# EAGLE design QRS_1_0 (EAGLE 7.6.0)
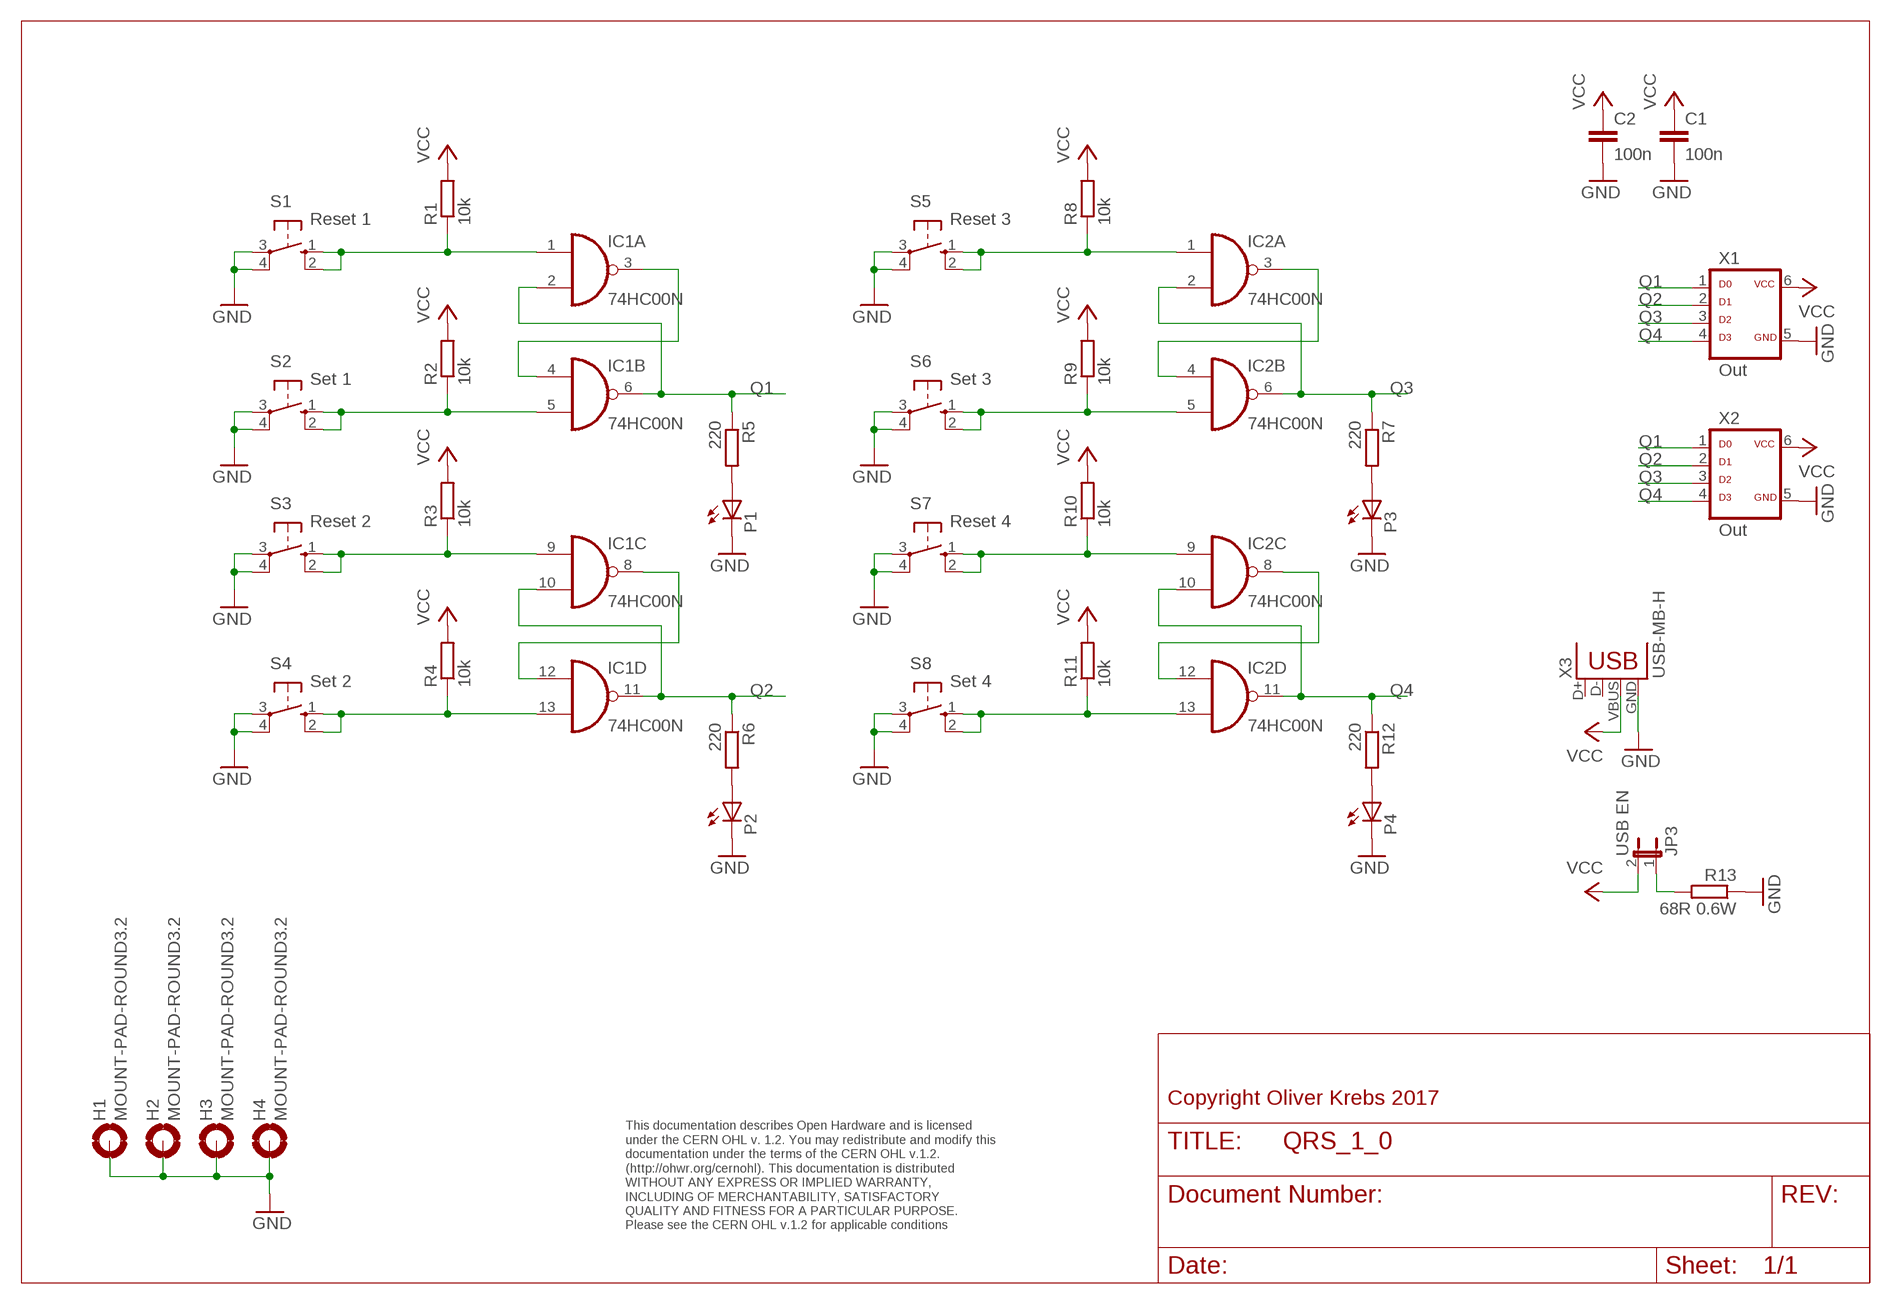
[diagram p0: schematic, sheet 1]

## Parts
C1  100n  C-EU050-025X075  [C050-025X075]
C2  100n  C-EU050-025X075  [C050-025X075]
H1  MOUNT-PAD-ROUND3.2  [3,2-PAD]
H2  MOUNT-PAD-ROUND3.2  [3,2-PAD]
H3  MOUNT-PAD-ROUND3.2  [3,2-PAD]
H4  MOUNT-PAD-ROUND3.2  [3,2-PAD]
IC1  74HC00N  [DIL14]
IC2  74HC00N  [DIL14]
JP3  USB EN  JP1E  [JP1]
P1  LED3MM  [LED3MM]
P2  LED3MM  [LED3MM]
P3  LED3MM  [LED3MM]
P4  LED3MM  [LED3MM]
R1  10k  R-EU_0207/10  [0207/10]
R2  10k  R-EU_0207/10  [0207/10]
R3  10k  R-EU_0207/10  [0207/10]
R4  10k  R-EU_0207/10  [0207/10]
R5  220  R-EU_0207/10  [0207/10]
R6  220  R-EU_0207/10  [0207/10]
R7  220  R-EU_0207/10  [0207/10]
R8  10k  R-EU_0207/10  [0207/10]
R9  10k  R-EU_0207/10  [0207/10]
R10  10k  R-EU_0207/10  [0207/10]
R11  10k  R-EU_0207/10  [0207/10]
R12  220  R-EU_0207/10  [0207/10]
R13  68R 0.6W  R-EU_0207/10  [0207/10]
S1  Reset 1  10-XX  [B3F-10XX]
S2  Set 1  10-XX  [B3F-10XX]
S3  Reset 2  10-XX  [B3F-10XX]
S4  Set 2  10-XX  [B3F-10XX]
S5  Reset 3  10-XX  [B3F-10XX]
S6  Set 3  10-XX  [B3F-10XX]
S7  Reset 4  10-XX  [B3F-10XX]
S8  Set 4  10-XX  [B3F-10XX]
X1  Out  ML6D  [ML-6]
X2  Out  ML6D  [ML-6]
X3  USB-MB-H  [USB-MB-H]

## Nets
GND: C1.2 C2.2 H1.B3,2(MOUNT) H2.B3,2(MOUNT) H3.B3,2(MOUNT) H4.B3,2(MOUNT) P1.K(C) P2.K(C) P3.K(C) P4.K(C) R13.1 S1.3(P) S1.4(P1) S2.3(P) S2.4(P1) S3.3(P) S3.4(P1) S4.3(P) S4.4(P1) S5.3(P) S5.4(P1) S6.3(P) S6.4(P1) S7.3(P) S7.4(P1) S8.3(P) S8.4(P1) X1.5 X2.5 X3.GND
N$1: IC1.1(A:I0) R1.1 S1.1(S) S1.2(S1)
N$2: JP3.1 R13.2
N$3: IC1.3(A:O) IC1.4(B:I0)
N$4: IC1.5(B:I1) R2.1 S2.1(S) S2.2(S1)
N$5: IC1.9(C:I0) R3.1 S3.1(S) S3.2(S1)
N$6: IC1.13(D:I1) R4.1 S4.1(S) S4.2(S1)
N$8: IC1.8(C:O) IC1.12(D:I0)
N$9: P1.A R5.2
N$10: P2.A R6.2
N$11: IC2.1(A:I0) R8.1 S5.1(S) S5.2(S1)
N$12: IC2.5(B:I1) R9.1 S6.1(S) S6.2(S1)
N$13: IC2.9(C:I0) R10.1 S7.1(S) S7.2(S1)
N$14: P3.A R7.2
N$16: IC2.3(A:O) IC2.4(B:I0)
N$17: IC2.13(D:I1) R11.1 S8.1(S) S8.2(S1)
N$19: IC2.8(C:O) IC2.12(D:I0)
N$20: P4.A R12.2
Q1: IC1.2(A:I1) IC1.6(B:O) R5.1 X1.1 X2.1
Q2: IC1.10(C:I1) IC1.11(D:O) R6.1 X1.2 X2.2
Q3: IC2.2(A:I1) IC2.6(B:O) R7.1 X1.3 X2.3
Q4: IC2.10(C:I1) IC2.11(D:O) R12.1 X1.4 X2.4
VCC: C1.1 C2.1 JP3.2 R1.2 R2.2 R3.2 R4.2 R8.2 R9.2 R10.2 R11.2 X1.6 X2.6 X3.VBUS
Unconnected: X3.D+ X3.D-

## Notes on the sheet
- Copyright Oliver Krebs 2017
- This documentation describes Open Hardware and is licensed 
  under the CERN OHL v. 1.2. You may redistribute and modify this 
  documentation under the terms of the CERN OHL v.1.2. 
  (http://ohwr.org/cernohl). This documentation is distributed
  WITHOUT ANY EXPRESS OR IMPLIED WARRANTY, 
  INCLUDING OF MERCHANTABILITY, SATISFACTORY 
  QUALITY AND FITNESS FOR A PARTICULAR PURPOSE. 
  Please see the CERN OHL v.1.2 for applicable conditions

## Power pins joined to a net without a drawn wire
GND: IC1.7(P:GND) IC2.7(P:GND)
VCC: IC1.14(P:VCC) IC2.14(P:VCC)

## Library data of the parts
C1 C2 = 01-my_rcl:C-EU: CAPACITOR, European symbol
H1-H4 = holes:MOUNT-PAD-ROUND: MOUNTING PAD, round
IC1 IC2 = 74xx-eu:74*00: Quad 2-input NAND gate
JP3 = jumper:JP1E: JUMPER
P1-P4 = 01-my-led:LED: LED OSRAM: - CHIPLED LG R971, LG N971, LY N971, LG Q971, LY Q971, LO R971, LY R971 LH N974, LH R974 LS Q976, LO Q976, LY Q976 LO Q996 - Hyper CHIPLED LW Q18S LB Q993, LB Q99A, LB R99A - SideLED LS A670, LO A670, LY A670, LG A670, LP A670 LB A673, LV A673, LT A673, LW A673 LH A674 LY A675 LS A676, LA A676, LO A676, LY A676, LW A676 LS A679, LY A679, LG A679 - Hyper Micro SIDELED® LS Y876, LA Y876, LO Y876, LY Y876 LT Y87S - SmartLED LW L88C, LW L88S LB L89C, LB L89S, LG L890 LS L89K, LO L89K, LY L89K LS L896, LA L896, LO L896, LY L896 - TOPLED LS T670, LO T670, LY T670, LG T670, LP T670 LSG T670, LSP T670, LSY T670, LOP T670, LYG T670 LG T671, LOG T671, LSG T671 LB T673, LV T673, LT T673, LW T673 LH T674 LS T676, LA T676, LO T676, LY T676, LB T676, LH T676, LSB T676, LW T676 LB T67C, LV T67C, LT T67C, LS T67K, LO T67K, LY T67K, LW E67C LS E67B, LA E67B, LO E67B, LY E67B, LB E67C, LV E67C, LT E67C LW T67C LS T679, LY T679, LG T679 LS T770, LO T770, LY T770, LG T770, LP T770 LB T773, LV T773, LT T773, LW T773 LH T774 LS E675, LA E675, LY E675, LS T675 LS T776, LA T776, LO T776, LY T776, LB T776 LHGB T686 LT T68C, LB T68C - Hyper Mini TOPLED® LB M676 - Mini TOPLED Santana® LG M470 LS M47K, LO M47K, LY M47K Source: http://www.osram.convergy.de LUXEON: - LUMILED® LXK2-PW12-R00, LXK2-PW12-S00, LXK2-PW14-U00, LXK2-PW14-V00 LXK2-PM12-R00, LXK2-PM12-S00, LXK2-PM14-U00 LXK2-PE12-Q00, LXK2-PE12-R00, LXK2-PE12-S00, LXK2-PE14-T00, LXK2-PE14-U00 LXK2-PB12-K00, LXK2-PB12-L00, LXK2-PB12-M00, LXK2-PB14-N00, LXK2-PB14-P00, LXK2-PB14-Q00 LXK2-PR12-L00, LXK2-PR12-M00, LXK2-PR14-Q00, LXK2-PR14-R00 LXK2-PD12-Q00, LXK2-PD12-R00, LXK2-PD12-S00 LXK2-PH12-R00, LXK2-PH12-S00 LXK2-PL12-P00, LXK2-PL12-Q00, LXK2-PL12-R00 Source: www.luxeon.com KINGBRIGHT: KA-3528ASYC Source: www.kingbright.com
R1-R13 = 01-my_rcl:R-EU_: RESISTOR, European symbol
S1-S8 = switch-omron:10-XX: OMRON SWITCH; MPN: B3F-1000; OC_FARNELL: 176432; OC_NEWARK: 36M3542
X1 X2 = 01-my-con:ML6D
X3 = SparkFun-Connectors:USB: USB Connectors USB-B-PTH is fully proven SKU : PRT-00139/CONN-08278 USB-miniB is fully proven SKU : PRT-00587 USB-A-PCB is untested. USB-A-H is throughly reviewed, but untested. Spark Fun Electronics SKU : PRT-00437 USB-B-SMT is throughly reviewed, but untested. Needs silkscreen touching up. USB-A-S has not been used/tested USB-MB-H has not been used/tested USB-MICROB has been used. CONN-09505

## Board
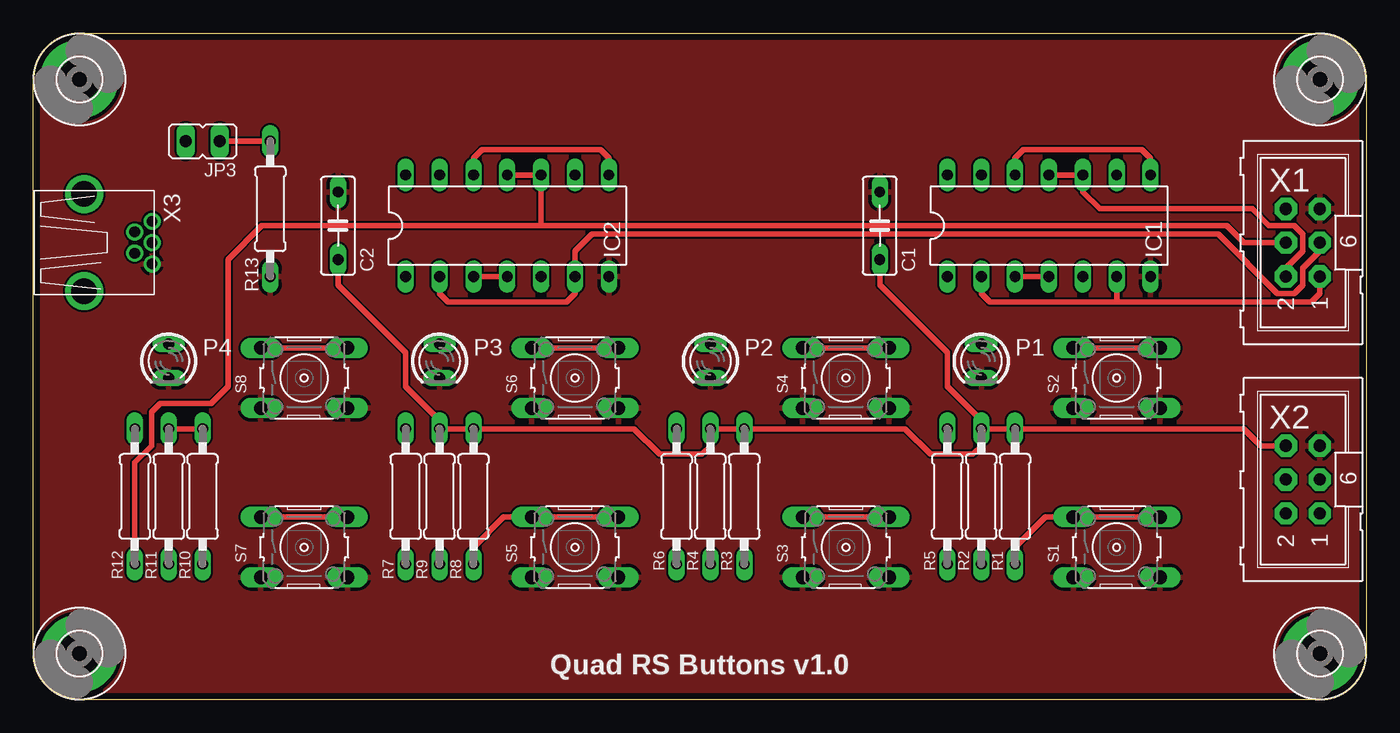
[diagram p1: board, top side]
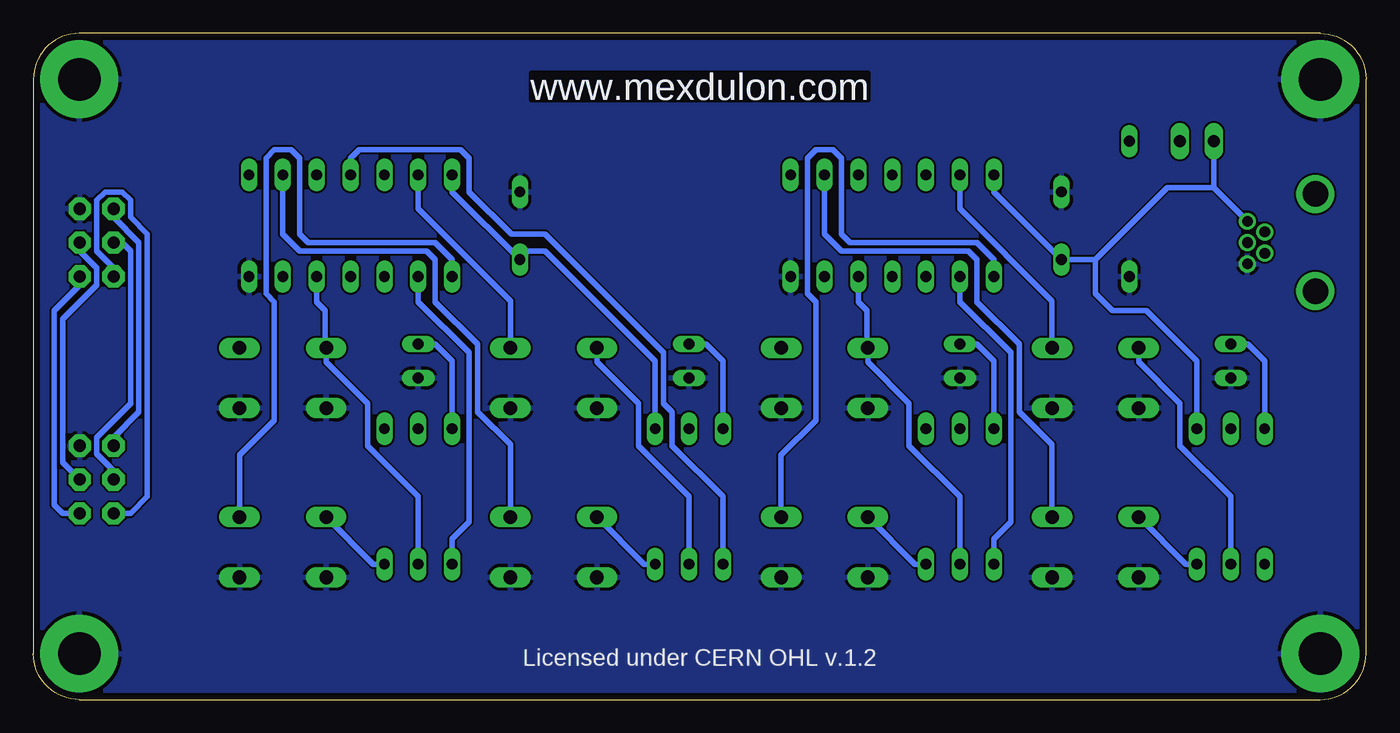
[diagram p2: board, bottom side, seen from below]

Size 100 x 50 mm. Coordinates in mm from the lower left corner, seen from the top.
Outline: 0,3.45 0,46.55 arc-90 3.45,50 96.55,50 arc-90 100,46.55 100,3.45 arc-90 96.55,0 3.45,0 arc-90 0,3.45
Copper layers (1*16): Top 0.035mm / dielectric 1.6mm / Bottom 0.035mm
Design rules "Elecrow_2-layer_PCB_eagle_rule": minimum track width 6mil, minimum drill 12mil, track to track 6mil, track to pad 6mil, pad to pad 6mil, via to via 8mil, smd to smd 0mil, copper to edge 20mil, drill to drill 10mil, minimum pad ring 6mil, minimum via ring 6mil, stop-mask expansion 0mil, vias tented up to drill 100mil, thermal gap 10mil

### Footprints (pad centres in the part's own frame; a part is rotated, then mirrored left to right if it is on the bottom)
C050-025X075 = drill 0.813 long: 1 -2.54,0; 2 2.54,0
3,2-PAD = drill 3.2 pad 5.842: B3,2 0,0
DIL14 = drill 0.813 long: 1 -7.62,-3.81; 2 -5.08,-3.81; 3 -2.54,-3.81; 4 0,-3.81; 5 2.54,-3.81; 6 5.08,-3.81; 7 7.62,-3.81; 8 7.62,3.81; 9 5.08,3.81; 10 2.54,3.81; 11 0,3.81; 12 -2.54,3.81; 13 -5.08,3.81; 14 -7.62,3.81
JP1 = drill 0.914 long: 1 0,-1.27; 2 0,1.27
LED3MM = drill 0.813 long: A -1.27,0; K 1.27,0
0207/10 = drill 0.813 long: 1 -5.08,0; 2 5.08,0
B3F-10XX = drill 1.016 long: 1 -3.251,2.261; 2 3.251,2.261; 3 -3.251,-2.261; 4 3.251,-2.261
ML-6 = drill 0.914 pad 1.676 octagon: 1 -2.54,-1.27; 2 -2.54,1.27; 3 0,-1.27; 4 0,1.27; 5 2.54,-1.27; 6 2.54,1.27
USB-MB-H = drill 0.8 pad 1.27: D+ 5.1,0; D- 3.8,0.8; GND 5.1,-1.6; ID 3.8,-0.8; VBUS 5.1,1.6 | drill 1.9: P$6 0,-3.65; P$7 0,3.65

### Placement (x,y rotation side)
C1  63.5,35.56 90 top
C2  22.86,35.56 90 top
H1  3.45,3.45 0 top
H2  3.45,46.55 0 top
H3  96.55,3.45 0 top
H4  96.55,46.55 0 top
IC1  76.2,35.56 0 top
IC2  35.56,35.56 0 top
JP3  12.7,41.91 90 top
P1  71.12,25.4 270 top
P2  50.8,25.4 270 top
P3  30.48,25.4 270 top
P4  10.16,25.4 270 top
R1  73.66,15.24 90 top
R2  71.12,15.24 90 top
R3  53.34,15.24 90 top
R4  50.8,15.24 90 top
R5  68.58,15.24 90 top
R6  48.26,15.24 90 top
R7  27.94,15.24 90 top
R8  33.02,15.24 90 top
R9  30.48,15.24 90 top
R10  12.7,15.24 90 top
R11  10.16,15.24 90 top
R12  7.62,15.24 90 top
R13  17.78,36.83 90 top
S1  81.28,11.43 0 top
S2  81.28,24.13 0 top
S3  60.96,11.43 0 top
S4  60.96,24.13 0 top
S5  40.64,11.43 0 top
S6  40.64,24.13 0 top
S7  20.32,11.43 0 top
S8  20.32,24.13 0 top
X1  95.25,34.29 90 top
X2  95.25,16.51 90 top
X3  3.81,34.29 0 top

### Tracks (layer width: path | path; a pad name or v marks a point on that pad's centre or on a via)
GND
  pour Bottom: 0,0 100.33,0 100.33,50.8 0,50.8
  pour Top: 0,50.16 100.97,50.16 100.97,0 0,0
N$1
  Top 0.406: S1.2 S1.1 75.92,13.69 73.66,11.43 R1.1
  Bottom 0.406: R1.1 74.5,10.16 S1.1 | IC1.1 68.58,33.02 69.85,34.29 79.38,34.29 80.01,34.92 80.01,40.64 80.64,41.27 81.92,41.27 82.55,40.64 82.55,30.48 81.92,29.84 81.92,20.95 84.53,18.34 S1.2
N$2
  Top 0.406: JP3.1 R13.2
N$3
  Top 0.406: IC1.3 IC1.4
N$4
  Top 0.406: S2.2 S2.1
  Bottom 0.406: R2.1 71.12,15.24 74.93,19.05 74.93,22.23 78.03,25.32 S2.1 78.11,26.47 78.11,29.21 78.74,29.84 IC1.5
N$5
  Top 0.406: S3.2 S3.1
  Bottom 0.406: R3.1 54.18,10.16 S3.1 | S3.2 64.21,19.13 66.67,21.59 66.67,26.67 69.85,29.84 69.85,33.02 70.48,33.66 80.01,33.66 81.28,34.92 IC1.9
N$6
  Top 0.406: S4.2 S4.1
  Bottom 0.406: S4.1 57.71,25.32 54.61,22.23 54.61,19.05 50.8,15.24 R4.1 | S4.2 64.21,29.92 71.12,36.83 IC1.13
N$8
  Top 0.406: IC1.12 73.66,40.64 74.3,41.27 83.19,41.27 83.82,40.64 IC1.8
N$9
  Bottom 0.406: P1.A 69.85,26.67 68.58,25.4 R5.2
N$10
  Bottom 0.406: P2.A 49.53,26.67 48.26,25.4 R6.2
N$11
  Top 0.406: S5.2 S5.1 35.28,13.69 33.02,11.43 R8.1
  Bottom 0.406: R8.1 33.86,10.16 S5.1 | IC2.1 27.94,33.02 29.21,34.29 38.73,34.29 39.37,34.92 39.37,40.64 40.01,41.27 41.27,41.27 41.91,40.64 41.91,30.48 41.27,29.84 41.27,20.95 43.89,18.34 S5.2
N$12
  Top 0.406: S6.2 S6.1
  Bottom 0.406: R9.1 30.48,15.24 34.29,19.05 34.29,22.23 37.39,25.32 S6.1 37.47,26.47 37.47,29.21 38.1,29.84 IC2.5
N$13
  Top 0.406: S7.1 S7.2
  Bottom 0.406: R10.1 13.54,10.16 S7.1 | S7.2 23.57,19.13 26.04,21.59 26.04,26.67 29.21,29.84 29.21,33.02 29.84,33.66 39.37,33.66 40.64,34.92 IC2.9
N$14
  Bottom 0.406: P3.A 29.21,26.67 27.94,25.4 R7.2
N$16
  Top 0.406: IC2.3 IC2.4
N$17
  Top 0.406: S8.1 S8.2
  Bottom 0.406: S8.1 17.07,25.32 13.97,22.23 13.97,19.05 10.16,15.24 R11.1 | S8.2 23.57,29.92 30.48,36.83 IC2.13
N$19
  Top 0.406: IC2.12 33.02,40.64 33.66,41.27 42.55,41.27 43.18,40.64 IC2.8
N$20
  Bottom 0.406: P4.A 8.89,26.67 7.62,25.4 R12.2
Q1
  Top 0.406: X1.1 96.52,30.48 95.89,29.84 81.28,29.84 | IC1.6 81.28,30.48 81.28,29.84 | IC1.2 71.12,30.48 71.75,29.84 81.28,29.84
  Bottom 0.406: X2.1 97.79,13.97 98.42,14.61 98.42,29.21 96.52,31.11 X1.1 | IC1.2 71.12,29.84 67.31,26.04 67.31,13.34 68.58,12.06 R5.1
Q2
  Top 0.406: IC1.11 IC1.10 78.74,38.1 80.01,36.83 91.44,36.83 92.71,35.56 94.61,35.56 95.25,34.92 95.25,33.66 93.98,32.38 X1.2
  Bottom 0.406: X1.2 93.98,32.38 95.25,33.66 95.25,37.47 94.61,38.1 93.34,38.1 92.71,37.47 92.71,36.2 91.44,34.92 91.44,15.24 92.71,13.97 X2.2 | R6.1 48.26,15.24 52.07,19.05 52.07,21.59 52.7,22.23 52.7,26.04 61.59,34.92 64.14,34.92 67.31,38.1 67.31,40.64 67.94,41.27 75.56,41.27 76.2,40.64 IC1.11
Q3
  Top 0.406: IC2.2 30.48,30.48 31.11,29.84 40.01,29.84 40.64,30.48 IC2.6 40.64,33.66 41.91,34.92 88.9,34.92 93.34,30.48 94.61,30.48 95.25,31.11 95.25,32.38 96.52,33.66 X1.3
  Bottom 0.406: X1.3 96.52,33.66 95.25,32.38 95.25,31.11 97.79,28.57 97.79,17.78 X2.3 | IC2.2 30.48,29.84 26.67,26.04 26.67,13.34 27.94,12.06 R7.1
Q4
  Top 0.406: IC2.11 IC2.10 38.1,35.56 | 38.1,35.56 89.53,35.56 90.81,34.29 X1.4 | R12.1 7.62,17.78 8.89,19.05 8.89,21.59 9.53,22.23 13.34,22.23 14.61,23.5 14.61,33.02 17.14,35.56 38.1,35.56
  Bottom 0.406: X1.4 93.34,34.29 92.71,33.66 92.71,22.23 95.25,19.68 95.25,18.41 93.98,17.14 X2.4
VCC
  Top 0.406: R11.2 R10.2 | C2.1 22.86,31.11 27.94,26.04 27.94,23.5 30.48,20.95 R9.2 R8.2 45.09,20.32 46.99,18.41 50.16,18.41 50.8,19.05 R4.2 R3.2 65.41,20.32 67.31,18.41 70.48,18.41 71.12,19.05 R2.2 | R2.2 R1.2 90.81,20.32 92.08,19.05 X2.6 | C1.1 63.5,31.11 68.58,26.04 68.58,23.5 71.12,20.95 R2.2
  Bottom 0.406: JP3.2 11.43,38.41 | 11.43,38.41 X3.VBUS | 20.32,33.02 C2.1 27.94,38.1 IC2.14 | 20.32,33.02 14.93,38.41 11.43,38.41 | R10.2 12.7,25.4 16.51,29.21 19.05,29.21 20.32,30.48 20.32,33.02 | X1.6 93.98,36.2 92.08,34.29 92.08,21.59 93.98,19.68 X2.6 | R3.2 53.34,25.4 61.59,33.66 62.87,33.66 C1.1 68.58,38.1 IC1.14

### Text on the board
Bottom: www.mexdulon.com
tNames: Quad RS Buttons v1.0
bNames: www.mexdulon.com | Licensed under CERN OHL v.1.2